# EAGLE design mainboard (EAGLE 9.4.0)
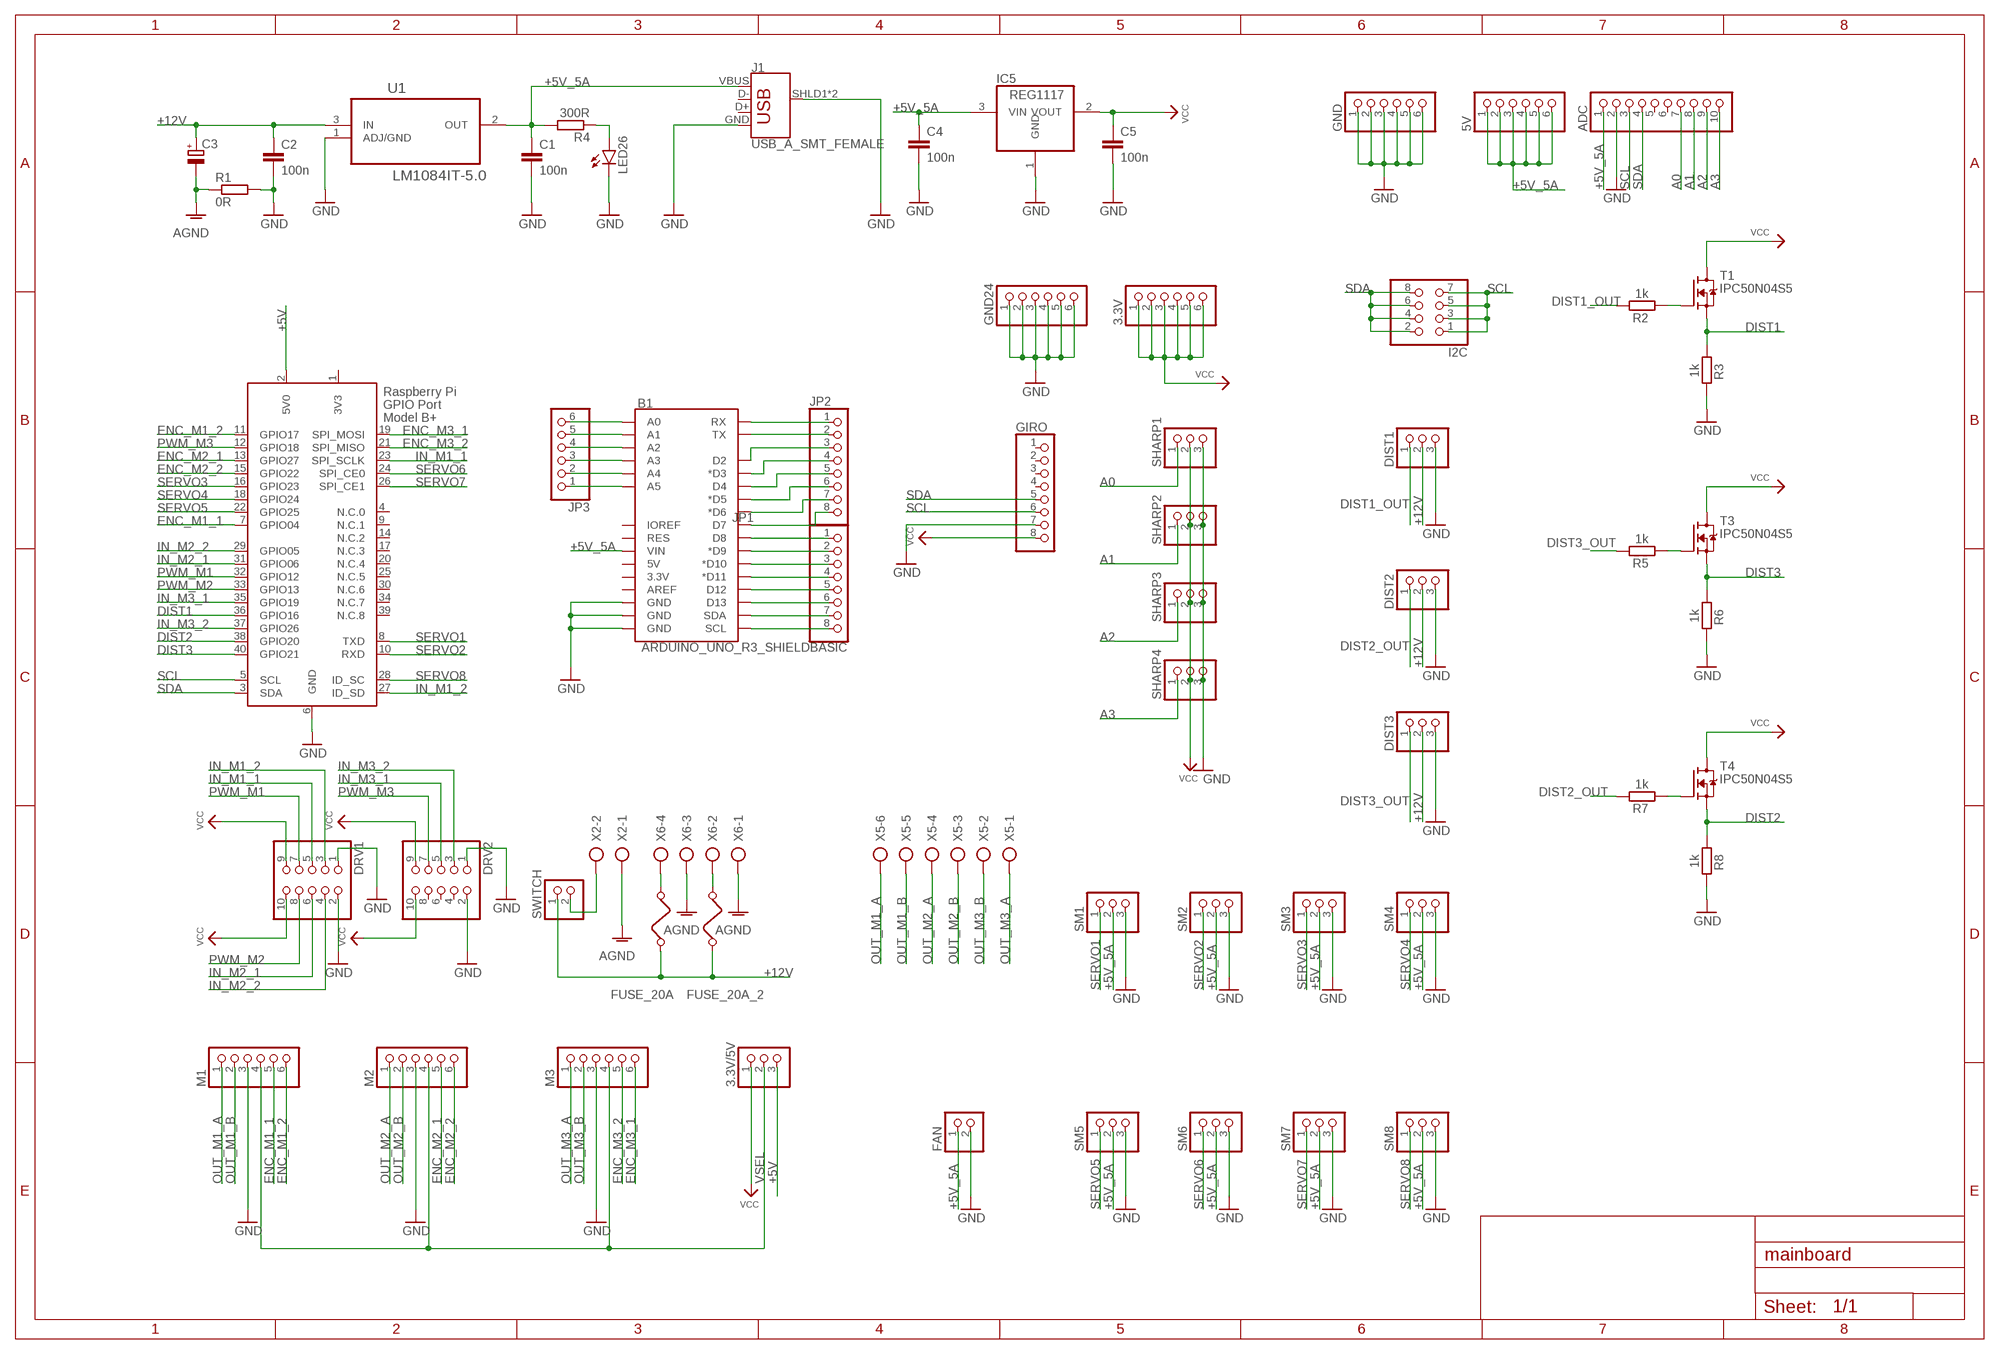
[diagram p0: schematic, sheet 1]

## Parts
3.3V  PINHD-1X6  [1X06]
3.3V/5V  PINHD-1X3  [1X03]
5V  PINHD-1X6  [1X06]
ADC  PINHD-1X10  [1X10]
B1  ARDUINO_UNO_R3_SHIELDBASIC  [UNO_R3_SHIELD]
C1  100n  C-EUC0805  [C0805]
C2  100n  C-EUC0805  [C0805]
C3  UCD1V221MNL1GS  [CAPAE830X1050]
C4  100n  C-EUC0805  [C0805]
C5  100n  C-EUC0805  [C0805]
DIST1  PINHD-1X3  [1X03]
DIST2  PINHD-1X3  [1X03]
DIST3  PINHD-1X3  [1X03]
DRV1  PINHD-2X5  [2X05]
DRV2  PINHD-2X5  [2X05]
FAN  PINHD-1X2  [1X02]
FUSE_20A  FUSE  [FUSE]
FUSE_20A_2  FUSE  [FUSE]
GIRO  PINHD-1X8  [1X08]
GND  PINHD-1X6  [1X06]
GND24  PINHD-1X6  [1X06]
I2C  PINHD-2X4  [2X04]
IC5  REG1117  [SOT223]
J1  USB_A_SMT_FEMALE  [USB-A-S-SILK-FEMALE]
JP1  PINHD-1X8  [1X08]
JP2  PINHD-1X8  [1X08]
JP3  PINHD-1X6  [1X06]
LED26  LEDCHIP-LED0805  [CHIP-LED0805]
M1  PINHD-1X6  [1X06]
M2  PINHD-1X6  [1X06]
M3  PINHD-1X6  [1X06]
R1  0R  R-EU_M0805  [M0805]
R2  1k  R-EU_R0805  [R0805]
R3  1k  R-EU_R0805  [R0805]
R4  300R  R-EU_R0805  [R0805]
R5  1k  R-EU_R0805  [R0805]
R6  1k  R-EU_R0805  [R0805]
R7  1k  R-EU_R0805  [R0805]
R8  1k  R-EU_R0805  [R0805]
SHARP1  PINHD-1X3  [1X03]
SHARP2  PINHD-1X3  [1X03]
SHARP3  PINHD-1X3  [1X03]
SHARP4  PINHD-1X3  [1X03]
SM1  PINHD-1X3  [1X03]
SM2  PINHD-1X3  [1X03]
SM3  PINHD-1X3  [1X03]
SM4  PINHD-1X3  [1X03]
SM5  PINHD-1X3  [1X03]
SM6  PINHD-1X3  [1X03]
SM7  PINHD-1X3  [1X03]
SM8  PINHD-1X3  [1X03]
SWITCH  PINHD-1X2  [1X02]
T1  IPC50N04S5  [PG-TDSON-8-33]
T3  IPC50N04S5  [PG-TDSON-8-33]
T4  IPC50N04S5  [PG-TDSON-8-33]
U1  LM1084IT-5.0  [TO254P470X1016X2222-3P]
X1  RASPI_BOARD_B+_FP  [RASPI_BOARD_B+_FULL_PAD]
X2  AK500/2  [AK500/2]
X5  AK500/6  [AK500/6]
X6  AK500/4  [AK500/4]

## Nets
+5V: 3.3V/5V.3 X1.2(5V0)
+5V_5A: 5V.1 5V.2 5V.3 5V.4 5V.5 5V.6 ADC.1 B1.VIN C1.1 C4.1 FAN.1 IC5.3(VIN) J1.VBUS R4.2 SM1.2 SM2.2 SM3.2 SM4.2 SM5.2 SM6.2 SM7.2 SM8.2 U1.2(OUT)
+12V: C2.1 C3.1(+) DIST1.2 DIST2.2 DIST3.2 FUSE_20A.1 FUSE_20A_2.1 SWITCH.1 U1.3(IN)
A0: ADC.7 SHARP1.1
A1: ADC.8 SHARP2.1
A2: ADC.9 SHARP3.1
A3: ADC.10 SHARP4.1
AGND: C3.2(-) R1.1 X2.1 X6.1 X6.3
DIST1: R3.1 T1.2(S) X1.36(GPIO16)
DIST1_OUT: DIST1.1 R2.2
DIST2: R8.1 T4.2(S) X1.38(GPIO20)
DIST2_OUT: DIST2.1 R7.2
DIST3: R6.1 T3.2(S) X1.40(GPIO21)
DIST3_OUT: DIST3.1 R5.2
ENC_M1_1: M1.5 X1.7(GPIO04)
ENC_M1_2: M1.6 X1.11(GPIO17)
ENC_M2_1: M2.5 X1.13(GPIO27)
ENC_M2_2: M2.6 X1.15(GPIO22)
ENC_M3_1: M3.6 X1.19(SPI_MOSI)
ENC_M3_2: M3.5 X1.21(SPI_MISO)
GND: ADC.2 B1.GND@0(GND) B1.GND@1(GND) B1.GND@2(GND) C1.2 C2.2 C4.2 C5.2 DIST1.3 DIST2.3 DIST3.3 DRV1.1 DRV1.2 DRV2.1 DRV2.2 FAN.2 GIRO.7 GND24.1 GND24.2 GND24.3 GND24.4 GND24.5 GND24.6 GND.1 GND.2 GND.3 GND.4 GND.5 GND.6 IC5.1(GND) J1.GND J1.SHLD1(SHIELD) J1.SHLD2(SHIELD) LED26.C M1.3 M2.3 M3.3 R1.2 R3.2 R6.2 R8.2 SHARP1.3 SHARP2.3 SHARP3.3 SHARP4.3 SM1.3 SM2.3 SM3.3 SM4.3 SM5.3 SM6.3 SM7.3 SM8.3 U1.1(ADJ/GND) X1.6(GND)
IN_M1_1: DRV1.5 X1.23(SPI_SCLK)
IN_M1_2: DRV1.3 X1.27(ID_SD)
IN_M2_1: DRV1.6 X1.31(GPIO06)
IN_M2_2: DRV1.4 X1.29(GPIO05)
IN_M3_1: DRV2.5 X1.35(GPIO19)
IN_M3_2: DRV2.3 X1.37(GPIO26)
N$1: FUSE_20A.2 X6.4
N$2: FUSE_20A_2.2 X6.2
N$3: SWITCH.2 X2.2
N$4: LED26.A R4.1
N$13: B1.RX JP2.1
N$14: B1.D8 JP1.1
N$15: B1.D9(*D9) JP1.2
N$16: B1.D10(*D10) JP1.3
N$17: B1.D11(*D11) JP1.4
N$18: B1.D12 JP1.5
N$19: B1.D13 JP1.6
N$20: B1.SDA JP1.7
N$21: B1.SCL JP1.8
N$22: B1.TX JP2.2
N$23: B1.D2 JP2.3
N$24: B1.D3(*D3) JP2.4
N$25: B1.D4 JP2.5
N$26: B1.D5(*D5) JP2.6
N$27: B1.D6(*D6) JP2.7
N$28: B1.D7 JP2.8
N$29: B1.A0 JP3.6
N$30: B1.A1 JP3.5
N$31: B1.A2 JP3.4
N$32: B1.A3 JP3.3
N$33: B1.A4 JP3.2
N$34: B1.A5 JP3.1
N$39: R2.1 T1.3(G)
N$41: R5.1 T3.3(G)
N$45: R7.1 T4.3(G)
OUT_M1_A: M1.1 X5.6
OUT_M1_B: M1.2 X5.5
OUT_M2_A: M2.1 X5.4
OUT_M2_B: M2.2 X5.3
OUT_M3_A: M3.1 X5.1
OUT_M3_B: M3.2 X5.2
PWM_M1: DRV1.7 X1.32(GPIO12)
PWM_M2: DRV1.8 X1.33(GPIO13)
PWM_M3: DRV2.7 X1.12(GPIO18)
SCL: ADC.3 GIRO.6 I2C.1 I2C.3 I2C.5 I2C.7 X1.5(SCL)
SDA: ADC.4 GIRO.5 I2C.2 I2C.4 I2C.6 I2C.8 X1.3(SDA)
SERVO1: SM1.1 X1.8(TXD)
SERVO2: SM2.1 X1.10(RXD)
SERVO3: SM3.1 X1.16(GPIO23)
SERVO4: SM4.1 X1.18(GPIO24)
SERVO5: SM5.1 X1.22(GPIO25)
SERVO6: SM6.1 X1.24(SPI_CE0)
SERVO7: SM7.1 X1.26(SPI_CE1)
SERVO8: SM8.1 X1.28(ID_SC)
VCC: 3.3V.1 3.3V.2 3.3V.3 3.3V.4 3.3V.5 3.3V.6 3.3V/5V.1 C5.1 DRV1.9 DRV1.10 DRV2.9 DRV2.10 GIRO.8 IC5.2(VOUT) SHARP1.2 SHARP2.2 SHARP3.2 SHARP4.2 T1.1(D) T3.1(D) T4.1(D)
VSEL: 3.3V/5V.2 M1.4 M2.4 M3.4
Unconnected: ADC.5 ADC.6 B1.3.3V B1.5V B1.AREF B1.IOREF B1.RES DRV2.4 DRV2.6 DRV2.8 GIRO.1 GIRO.2 GIRO.3 GIRO.4 J1.D+ J1.D- X1.4(N.C.0) X1.9(N.C.1) X1.14(N.C.2) X1.17(N.C.3) X1.20(N.C.4) X1.25(N.C.5) X1.30(N.C.6) X1.34(N.C.7) X1.39(N.C.8)

## Power pins joined to a net without a drawn wire
3V3: X1.1(3V3)

## Library data of the parts
3.3V 5V GND GND24 JP3 M1-M3 = pinhead:PINHD-1X6: PIN HEADER
3.3V/5V DIST1-DIST3 SHARP1-SHARP4 SM1-SM8 = pinhead:PINHD-1X3: PIN HEADER
ADC = pinhead:PINHD-1X10: PIN HEADER
B1 = SparkFun-Boards:ARDUINO_UNO_R3_SHIELD: Arduino R3 Shield Footprint Shield form compatible with the Arduino Uno R3. SparkFun Products: MG2639 Cellular Shield <https://www.sparkfun.com/products/13120> MIDI Shield <https://www.sparkfun.com/products/12898> R3 Stackable Headers Kit <https://www.sparkfun.com/products/11417>
C1 C2 C4 C5 = rcl:C-EU: CAPACITOR, European symbol; SPICEPREFIX: C
C3 = rosbotlib:UCD1V221MNL1GS
DRV1 DRV2 = pinhead:PINHD-2X5: PIN HEADER
FAN SWITCH = pinhead:PINHD-1X2: PIN HEADER
FUSE_20A FUSE_20A_2 = special:FUSE: FUSE 5 x 20 mm
GIRO JP1 JP2 = pinhead:PINHD-1X8: PIN HEADER
I2C = pinhead:PINHD-2X4: PIN HEADER
IC5 = burr-brown:REG1117: 800mA and 1A Low Dropout (LDO) Positive Regulator 1.8V, 2.5V, 2.85V, 3.3V, 5V, and Adj; MPN: REG1117; OC_FARNELL: 1097566; OC_NEWARK: 14P6981
J1 = SparkFun-Connectors:USB_A: USB-A Connector Male and female variants, as well as PTH and SMT variants SparkFun Products: SparkFun XBee Explorer Dongle <https://www.sparkfun.com/products/11697> PTH Male SparkFun MicroView-USB Programmer <https://www.sparkfun.com/products/12924> SMT Male SparkFun USB Type A Female Breakout <https://www.sparkfun.com/products/12700> SMT Female; PROD_ID: CONN-09520; SF_ID: PRT-09011
LED26 = led:LED: LED OSRAM: - CHIPLED LG R971, LG N971, LY N971, LG Q971, LY Q971, LO R971, LY R971 LH N974, LH R974 LS Q976, LO Q976, LY Q976 LO Q996 - Hyper CHIPLED LW Q18S LB Q993, LB Q99A, LB R99A - SideLED LS A670, LO A670, LY A670, LG A670, LP A670 LB A673, LV A673, LT A673, LW A673 LH A674 LY A675 LS A676, LA A676, LO A676, LY A676, LW A676 LS A679, LY A679, LG A679 - Hyper Micro SIDELED® LS Y876, LA Y876, LO Y876, LY Y876 LT Y87S - SmartLED LW L88C, LW L88S LB L89C, LB L89S, LG L890 LS L89K, LO L89K, LY L89K LS L896, LA L896, LO L896, LY L896 - TOPLED LS T670, LO T670, LY T670, LG T670, LP T670 LSG T670, LSP T670, LSY T670, LOP T670, LYG T670 LG T671, LOG T671, LSG T671 LB T673, LV T673, LT T673, LW T673 LH T674 LS T676, LA T676, LO T676, LY T676, LB T676, LH T676, LSB T676, LW T676 LB T67C, LV T67C, LT T67C, LS T67K, LO T67K, LY T67K, LW E67C LS E67B, LA E67B, LO E67B, LY E67B, LB E67C, LV E67C, LT E67C LW T67C LS T679, LY T679, LG T679 LS T770, LO T770, LY T770, LG T770, LP T770 LB T773, LV T773, LT T773, LW T773 LH T774 LS E675, LA E675, LY E675, LS T675 LS T776, LA T776, LO T776, LY T776, LB T776 LHGB T686 LT T68C, LB T68C - Hyper Mini TOPLED® LB M676 - Mini TOPLED Santana® LG M470 LS M47K, LO M47K, LY M47K Source: http://www.osram.convergy.de LUXEON: - LUMILED® LXK2-PW12-R00, LXK2-PW12-S00, LXK2-PW14-U00, LXK2-PW14-V00 LXK2-PM12-R00, LXK2-PM12-S00, LXK2-PM14-U00 LXK2-PE12-Q00, LXK2-PE12-R00, LXK2-PE12-S00, LXK2-PE14-T00, LXK2-PE14-U00 LXK2-PB12-K00, LXK2-PB12-L00, LXK2-PB12-M00, LXK2-PB14-N00, LXK2-PB14-P00, LXK2-PB14-Q00 LXK2-PR12-L00, LXK2-PR12-M00, LXK2-PR14-Q00, LXK2-PR14-R00 LXK2-PD12-Q00, LXK2-PD12-R00, LXK2-PD12-S00 LXK2-PH12-R00, LXK2-PH12-S00 LXK2-PL12-P00, LXK2-PL12-Q00, LXK2-PL12-R00 Source: www.luxeon.com KINGBRIGHT: KA-3528ASYC Source: www.kingbright.com
R1-R8 = rcl:R-EU_: RESISTOR, European symbol; SPICEPREFIX: R
T1 T3 T4 = transistors:IPC50N04S5
U1 = LM1084IT-5.0:LM1084IT-5.0: IC, LDO VOLT REG, 5V, 5A; AVAILABILITY: Unavailable; DESCRIPTION: Linear Voltage Regulator IC 1 Output 5A TO-220-3; MF: Texas Instruments; MP: LM1084IT-5.0; PACKAGE: TO-220 Texas Instruments; PRICE: None
X1 = raspberrypi_bastelstube_v13:RASPI_BOARD_B+: Raspberry Pi GPIO connector with markings for the outer dimensions of the Raspberry Pi board model B+ with different sets of drill holes or mounting pads
X2 = con-ptr500:AK500/2: CONNECTOR; OC_FARNELL: unknown; OC_NEWARK: unknown
X5 = con-ptr500:AK500/6: CONNECTOR; OC_FARNELL: unknown; OC_NEWARK: unknown
X6 = con-ptr500:AK500/4: CONNECTOR; OC_FARNELL: unknown; OC_NEWARK: unknown

## Board
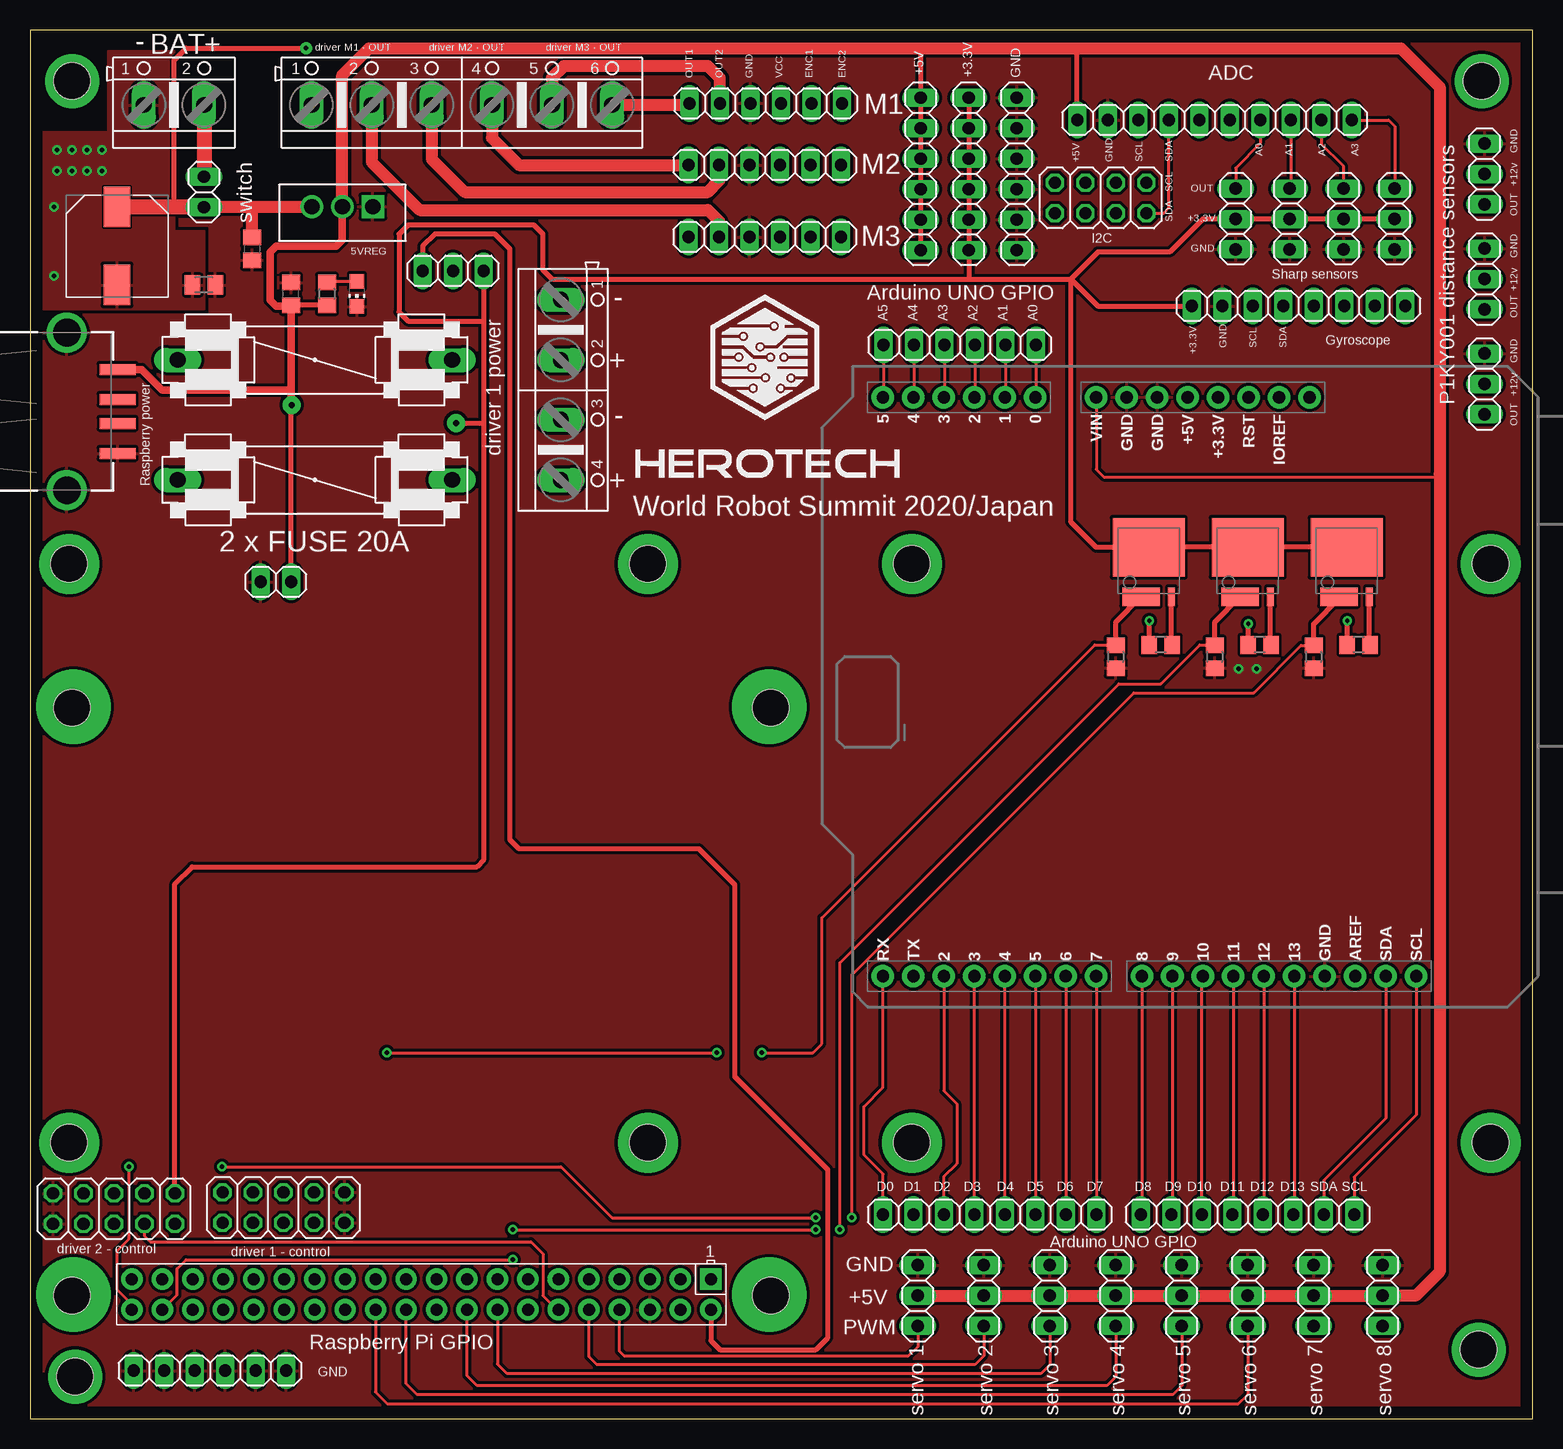
[diagram p1: board, top side]
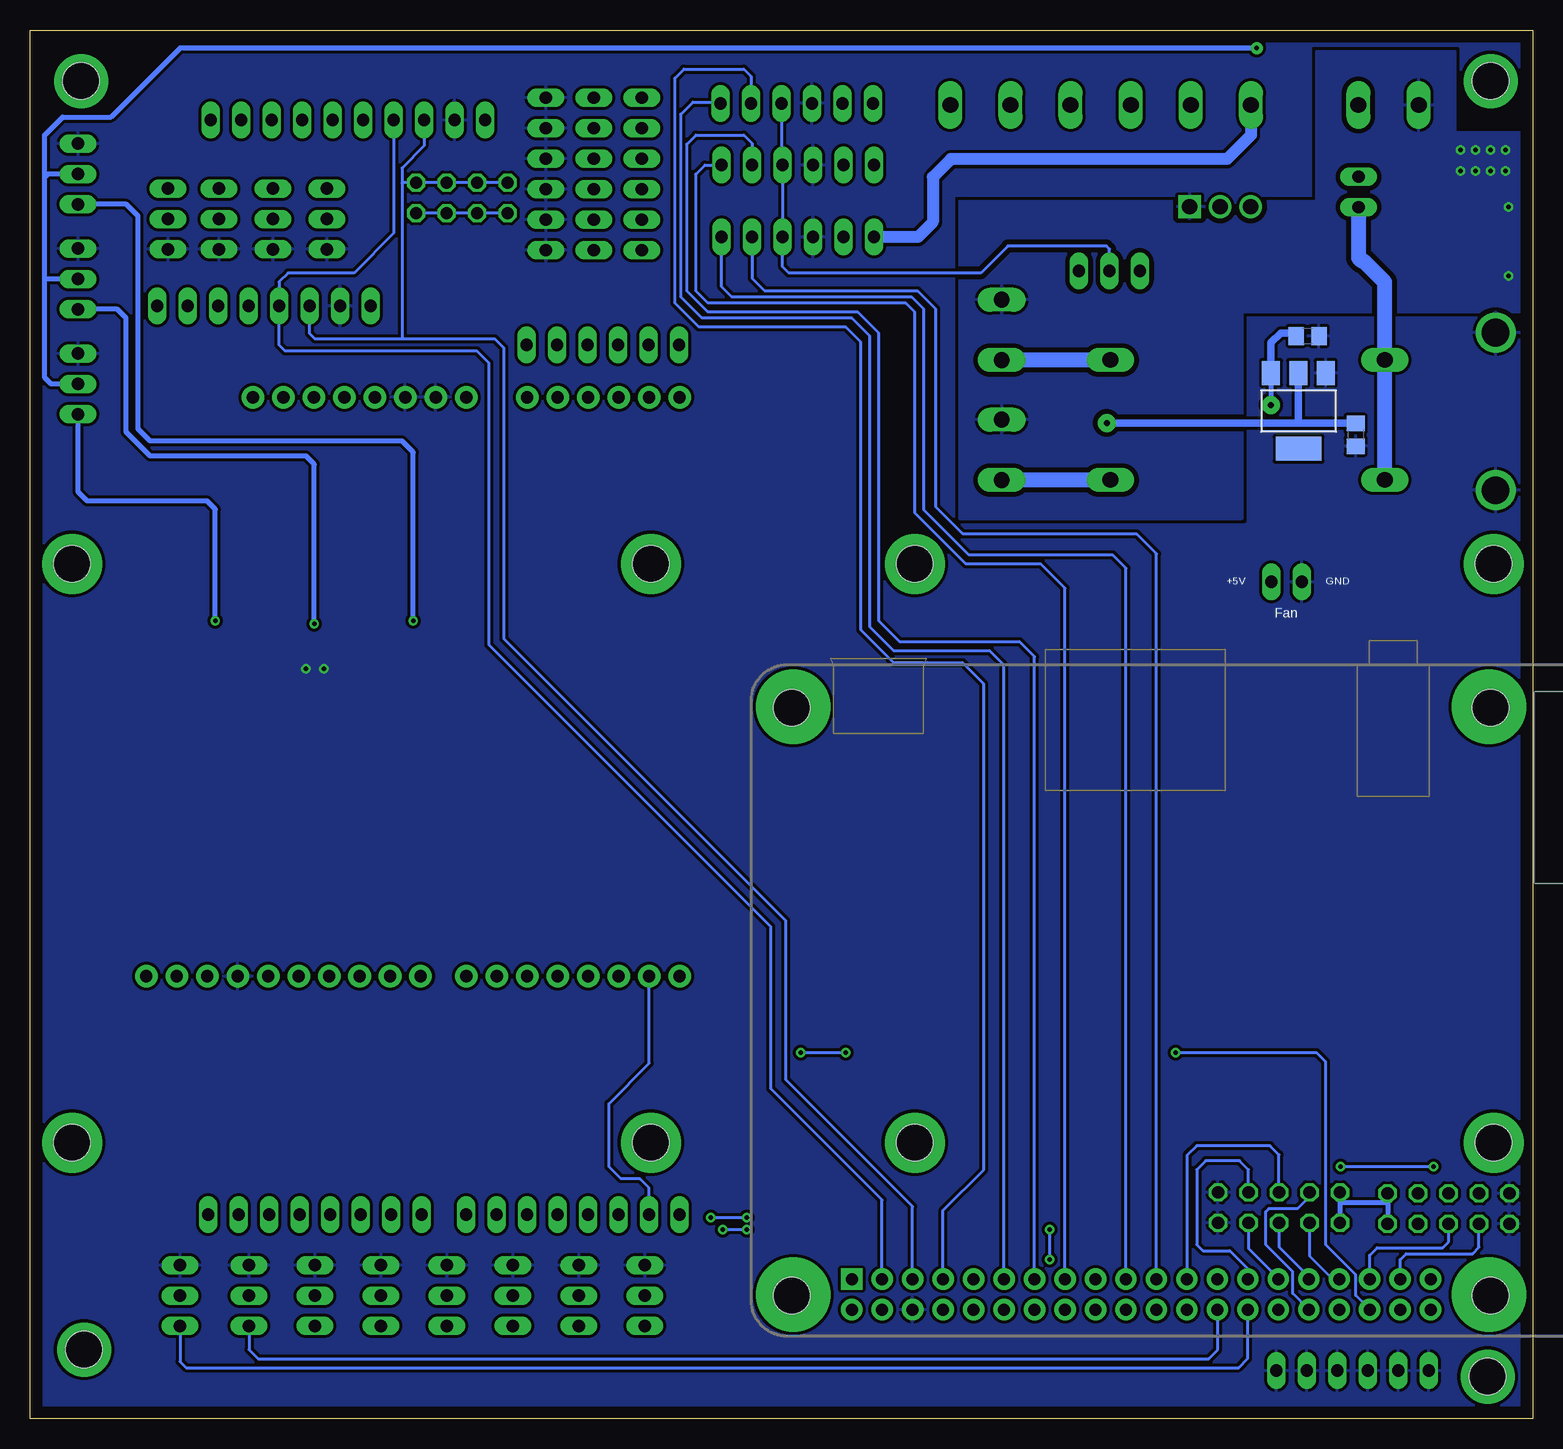
[diagram p2: board, bottom side, seen from below]

Size 125.25 x 115.75 mm. Coordinates in mm from the lower left corner, seen from the top.
Outline: 0,0 125.25,0 125.25,115.75 0,115.75 0,0
Copper layers (1*16): Top 0.035mm / dielectric 1.5mm / Bottom 0.035mm
Design rules "default": minimum track width 6mil, minimum drill 0.35mm, track to track 6mil, track to pad 6mil, pad to pad 6mil, via to via 6mil, smd to smd 6mil, copper to edge 40mil, drill to drill 6mil, minimum pad ring 10mil, minimum via ring 8mil, stop-mask expansion 4mil, vias tented up to drill 0mil, thermal gap 10mil
Holes 3 mm at 3.5,111.5 3.25,71.25 51.5,71.25 3.25,23 51.5,23 73.5,71.25 73.5,23 121.75,71.25 121.75,23 3.5,59.25 61.75,59.25 61.75,10.25 3.5,10.25 120.75,5.75 121,111.5 3.75,3.5

### Footprints (pad centres in the part's own frame; a part is rotated, then mirrored left to right if it is on the bottom)
1X06 = drill 1.016 long: 1 -6.35,0; 2 -3.81,0; 3 -1.27,0; 4 1.27,0; 5 3.81,0; 6 6.35,0
1X03 = drill 1.016 long: 1 -2.54,0; 2 0,0; 3 2.54,0
1X10 = drill 1.016 long: 1 -11.43,0; 2 -8.89,0; 3 -6.35,0; 4 -3.81,0; 5 -1.27,0; 6 1.27,0; 7 3.81,0; 8 6.35,0; 9 8.89,0; 10 11.43,0
UNO_R3_SHIELD = drill 1.016 pad 1.88: 3.3V 24.13,-2.54; 5V 24.13,0; A0 24.13,12.7; A1 24.13,15.24; A2 24.13,17.78; A3 24.13,20.32; A4 24.13,22.86; A5 24.13,25.4; AREF -24.13,-13.97; D2 -24.13,20.32; D3 -24.13,17.78; D4 -24.13,15.24; D5 -24.13,12.7; D6 -24.13,10.16; D7 -24.13,7.62; D8 -24.13,3.81; D9 -24.13,1.27; D10 -24.13,-1.27; D11 -24.13,-3.81; D12 -24.13,-6.35; D13 -24.13,-8.89; GND@0 24.13,2.54; GND@1 24.13,5.08; GND@2 -24.13,-11.43; IOREF 24.13,-7.62; NC 24.13,-10.16; RES 24.13,-5.08; RX -24.13,25.4; SCL -24.13,-19.05; SDA -24.13,-16.51; TX -24.13,22.86; VIN 24.13,7.62
C0805 = smd 1.3 x 1.5: 1 -0.95,0; 2 0.95,0
CAPAE830X1050 = smd 3.414 x 2.212: 1 -3.251,0; 2 3.251,0
2X05 = drill 1.016 octagon: 1 -5.08,-1.27; 2 -5.08,1.27; 3 -2.54,-1.27; 4 -2.54,1.27; 5 0,-1.27; 6 0,1.27; 7 2.54,-1.27; 8 2.54,1.27; 9 5.08,-1.27; 10 5.08,1.27
1X02 = drill 1.016 long: 1 -1.27,0; 2 1.27,0
FUSE = drill 1.321 long: 1 -11.43,0; 2 11.43,0
1X08 = drill 1.016 long: 1 -8.89,0; 2 -6.35,0; 3 -3.81,0; 4 -1.27,0; 5 1.27,0; 6 3.81,0; 7 6.35,0; 8 8.89,0
2X04 = drill 1.016 octagon: 1 -3.81,-1.27; 2 -3.81,1.27; 3 -1.27,-1.27; 4 -1.27,1.27; 5 1.27,-1.27; 6 1.27,1.27; 7 3.81,-1.27; 8 3.81,1.27
SOT223 = smd 1.499 x 2.007: 1 -2.261,-3.15; 2 0.025,-3.15; 3 2.311,-3.15 | smd 3.81 x 2.007: 4 0,3.15
USB-A-S-SILK-FEMALE = smd 3 x 0.9: D+ 7.212,-1; D- 7.212,1; GND 7.212,-3.5; VBUS 7.212,3.5 | drill 2.311: SHLD1 3,-6.566; SHLD2 3,6.566
CHIP-LED0805 = smd 1.2 x 1.2: A 0,-1.05; C 0,1.05
M0805 = smd 1.3 x 1.6: 1 -0.95,0; 2 0.95,0
R0805 = smd 1.3 x 1.5: 1 -0.95,0; 2 0.95,0
PG-TDSON-8-33 = smd 6 x 4.9: 1 0,1.13 | smd 3.14 x 1.55: 2 -0.635,-2.995 | smd 0.6 x 1.55: 3 1.905,-2.995
TO254P470X1016X2222-3P = drill 1.27 square: 1 -5.08,-1.016 | drill 1.27: 2 -2.54,-1.016; 3 0,-1.016
RASPI_BOARD_B+_FULL_PAD = drill 1 pad 1.778 square: 1 8.37,51.23 | drill 1 pad 1.778: 2 8.37,53.77; 3 10.91,51.23; 4 10.91,53.77; 5 13.45,51.23; 6 13.45,53.77; 7 15.99,51.23; 8 15.99,53.77; 9 18.53,51.23; 10 18.53,53.77; 11 21.07,51.23; 12 21.07,53.77; 13 23.61,51.23; 14 23.61,53.77; 15 26.15,51.23; 16 26.15,53.77; 17 28.69,51.23; 18 28.69,53.77; 19 31.23,51.23; 20 31.23,53.77; 21 33.77,51.23; 22 33.77,53.77; 23 36.31,51.23; 24 36.31,53.77; 25 38.85,51.23; 26 38.85,53.77; 27 41.39,51.23; 28 41.39,53.77; 29 43.93,51.23; 30 43.93,53.77; 31 46.47,51.23; 32 46.47,53.77; 33 49.01,51.23; 34 49.01,53.77; 35 51.55,51.23; 36 51.55,53.77; 37 54.09,51.23; 38 54.09,53.77; 39 56.63,51.23; 40 56.63,53.77 | drill 2.75 pad 6.2: DRILL_1 3.5,52.5; DRILL_2 61.5,52.5; DRILL_3 3.5,3.5; DRILL_4 61.5,3.5
AK500/2 = drill 1.321 long: 1 -2.515,0; 2 2.515,0
AK500/6 = drill 1.321 long: 1 -12.522,0; 2 -7.518,0; 3 -2.515,0; 4 2.515,0; 5 7.518,0; 6 12.522,0
AK500/4 = drill 1.321 long: 1 -7.518,0; 2 -2.489,0; 3 2.489,0; 4 7.518,0

### Placement (x,y rotation side)
3.3V  78.25,103.75 270 top
3.3V/5V  35.27,95.67 180 top
5V  74.25,103.75 270 top
ADC  98.75,108.25 0 top
B1  96.5,61 90 top
C1  21.75,93.75 90 top
C2  18.5,97.5 270 top
C3  7.25,97.75 270 top
C4  18.75,90.25 0 bottom
C5  14.75,82 270 bottom
DIST1  121.25,103.75 90 top
DIST2  121.25,95 90 top
DIST3  121.25,86.25 90 top
DRV1  21.13,17.58 180 top
DRV2  7,17.5 0 top
FAN  20.5,69.75 180 top
FUSE_20A  23.75,78.25 0 top
FUSE_20A_2  23.75,88.25 0 top
GIRO  105.75,92.75 180 top
GND  15,4 0 top
GND24  82.25,103.75 270 top
I2C  89.25,101.75 180 top
IC5  19.5,84 180 bottom
J1  0.08,83.95 0 top
JP1  101.5,17 0 top
JP2  80,17 0 top
JP3  77.5,89.5 0 top
LED26  27.25,93.75 180 top
M1  61.33,109.63 0 top
M2  61.25,104.5 0 top
M3  61.25,98.5 0 top
R1  14.5,94.5 0 top
R2  94.25,64.5 180 top
R3  90.5,63.5 270 top
R4  24.75,93.75 270 top
R5  110.75,64.5 180 top
R6  107,63.5 270 top
R7  102.5,64.5 180 top
R8  98.75,63.5 270 top
SHARP1  100.5,100 270 top
SHARP2  105,100 270 top
SHARP3  109.5,100 270 top
SHARP4  113.75,100 270 top
SM1  74,10.25 90 top
SM2  79.5,10.25 90 top
SM3  85,10.25 90 top
SM4  90.5,10.25 90 top
SM5  96,10.25 90 top
SM6  101.5,10.25 90 top
SM7  107,10.25 90 top
SM8  112.75,10.25 90 top
SWITCH  14.5,102.25 90 top
T1  93.25,71.5 0 top
T3  109.75,71.5 0 top
T4  101.5,71.5 0 top
U1  23.5,100 180 top
X1  65.12,62.85 180 top
X2  12,109.5 0 top
X5  36,109.5 0 top
X6  44.25,85.75 270 top

### Tracks (layer width: path | path; a pad name or v marks a point on that pad's centre or on a via)
+5V
  Top 0.406: X1.2 56.75,6.5 57.5,5.75 65.5,5.75 66.5,6.75 66.5,20.75 58.75,28.5 58.75,44.5 55.75,47.5 40.75,47.5 40,48.25 40,97.5 38.75,98.75 33.75,98.75 32.73,97.73 3.3V/5V.3
+5V_5A  (via drill 0.5 pad 1.5)
  Top 0.254: 117.5,78.75 117.25,78.5 89.5,78.5 88.88,79.12 B1.VIN | 74.25,113.98 74.5,114.23
  Top 0.406: R4.2 C1.1 21.7,92.75 | 5V.6 5V.5 5V.4 5V.3 5V.2 5V.1 74.25,113.98 | ADC.1 87.25,108.32 87.25,114.23 | v21.81,84.5 21.78,84.53 | 21.78,84.53 21.75,84.56 | FAN.1 21.77,84.52 21.78,84.53
  Top 0.61: J1.VBUS 9.3,87.45 11,85.75 21.75,85.75 | 21.75,84.56 21.75,85.75 | 21.75,85.75 C1.1 | U1.2 26.04,98.25 25.54,97.75 20.5,97.75 20,97.25 20,93.25 20.5,92.75 21.7,92.75
  Top 1.016: SM1.2 SM2.2 SM3.2 SM4.2 SM5.2 SM6.2 SM7.2 SM8.2 115.5,10.25 117.5,12.25 117.5,78.75 117.5,111 114.27,114.23 87.25,114.23 74.5,114.23 28.27,114.23 26.04,112 U1.2
  Bottom 0.406: IC5.3 v21.81,84.5
  Bottom 0.61: C4.1 19.95,90.5 21,90.5 21.81,89.69 IC5.3
+12V  (via drill 0.35 pad 1)
  Top 0.406: SWITCH.1 17.23,100.98 | 12,100.98 12,113.25 13,114.25 v23,114.25
  Top 1.016: SWITCH.1 14.54,101.02 18.75,101.02 | 18.75,101.02 U1.3 | C2.1 18.5,100.77 18.75,101.02
  Top 1.27: C3.1 7.27,100.98 12,100.98 SWITCH.1
  Bottom 0.406: DIST3.2 123.5,86.25 124.03,86.78 124.03,95 | 124.03,95 124.03,103.5 | 124.03,103.5 124.03,107 122.53,108.5 118.5,108.5 112.75,114.25 v23,114.25 | DIST1.2 123.78,103.75 124.03,103.5 | DIST2.2 124.03,95
  Bottom 1.27: FUSE_20A.1 FUSE_20A_2.1 12.32,94.75 14.07,96.5 14.25,96.5 14.5,96.75 SWITCH.1
A0
  Top 0.254: ADC.7 102.56,106.31 100.5,104.25 SHARP1.1
A1
  Top 0.254: ADC.8 105.1,102.64 SHARP2.1
A2
  Top 0.254: ADC.9 107.64,106.25 109.5,104.39 SHARP3.1
A3
  Top 0.254: ADC.10 113.25,108.25 113.75,107.75 SHARP4.1
AGND  (via drill 0.35 pad 0.6)
  other vias: 2.25,105.75 3.5,105.75 4.75,105.75 6,105.75 2.25,104 3.5,104 4.75,104 6,104 2,101 2,95.25
  pour Top: 6.5,114 6.5,107.25 1,107.25 1,92.5 14.5,92.5 14.5,99 12,99 12,114
  pour Bottom (isolate 0.406): 6.5,114 6.5,107.25 1,107.25 1,92.25 24.25,92.25 24.25,75 47.75,75 47.75,101.5 18,101.5 18,114
DIST1  (via drill 0.35 pad 0.5)
  Top 0.254: v29.75,30.5 v57.25,30.5 | v61,30.5 65.25,30.5 66,31.25 66,41.75 88.75,64.5 90.5,64.5
  Top 0.406: T1.2 90.5,66.39 90.5,64.5 R3.1
  Bottom 0.254: X1.36 14.75,10.26 14.75,12 17.25,14.5 17.25,29.75 18,30.5 v29.75,30.5 | v57.25,30.5 v61,30.5
DIST1_OUT  (via drill 0.35 pad 0.5)
  Top 0.406: R2.2 v93.3,66.5
  Bottom 0.406: v93.3,66.5 93.3,80.55 94.25,81.5 115.25,81.5 116.25,82.5 116.25,100.25 117.21,101.21 DIST1.1
DIST2  (via drill 0.35 pad 0.5)
  Top 0.254: X1.38 12.25,10.3 12.25,12.5 13,13.25 v40.25,13.25 | v40.25,15.75 v65.5,15.75 | v67.5,15.75 67.5,38 90.75,61.25 94.25,61.25 97.5,64.5 98.75,64.5
  Top 0.406: T4.2 98.75,66.39 98.75,64.5 R8.1
  Bottom 0.254: v40.25,13.25 v40.25,15.75 | v65.5,15.75 v67.5,15.75
DIST2_OUT  (via drill 0.35 pad 0.5)
  Top 0.406: R7.2 v101.55,66.25
  Bottom 0.406: v101.55,66.25 101.55,79.55 102.25,80.25 115.25,80.25 117.25,82.25 117.25,91.75 117.96,92.46 DIST2.1
DIST3  (via drill 0.35 pad 0.5)
  Top 0.254: X1.40 8.49,9.51 7.25,10.75 7.25,14 8.25,15 v8.25,21 | v16,21 44.25,21 48.5,16.75 v65.5,16.75 | R6.1 105.95,64.45 102,60.5 92,60.5 68.5,37 v68.5,16.75
  Top 0.406: R6.1 107,66.25 109.11,68.36 T3.2
  Bottom 0.254: v8.25,21 v16,21 | v65.5,16.75 v68.5,16.75
DIST3_OUT  (via drill 0.35 pad 0.5)
  Top 0.406: R5.2 v109.8,66.5
  Bottom 0.406: DIST3.1 121.25,77.25 120.5,76.5 110.5,76.5 109.8,75.8 v109.8,66.5
ENC_M1_1
  Bottom 0.254: X1.7 49.13,17.37 45.75,20.75 45.75,61.25 47.5,63 53.25,63 56,65.75 56,89.75 57.25,91 69.5,91 71.5,93 71.5,111.75 70.75,112.5 65.75,112.5 65.14,111.89 M1.5
ENC_M1_2
  Bottom 0.254: X1.11 44.05,62.8 45.25,64 53.25,64 55.25,66 55.25,90.25 56.75,91.75 69.25,91.75 71,93.5 71,108.75 70,109.75 67.8,109.75 M1.6
ENC_M2_1
  Bottom 0.254: X1.13 41.51,63.51 42.75,64.75 52.75,64.75 54.5,66.5 54.5,90.5 56.25,92.25 68.75,92.25 70.5,94 70.5,106.25 69.75,107 65.75,107 65.06,106.31 M2.5
ENC_M2_2
  Bottom 0.254: X1.15 38.97,69.22 41,71.25 47.25,71.25 51.5,75.5 51.5,92.25 52.25,93 68.75,93 69.75,94 69.75,103.75 69,104.5 M2.6
ENC_M3_1
  Bottom 0.254: X1.19 33.89,70.89 35,72 47,72 50.75,75.75 50.75,92.5 51.75,93.5 66.75,93.5 67.6,94.35 M3.6
ENC_M3_2
  Bottom 0.254: X1.21 31.35,72.1 33,73.75 47.5,73.75 49.75,76 49.75,92.5 51.25,94 64,94 65.06,95.06 M3.5
GND  (via drill 0.35 pad 0.5)
  other vias: 100.75,62.5 102.25,62.5
  pour Top (isolate 0.254, rank 2): -0.25,114.75 124.75,114.75 124.75,0 -0.25,0
  pour Bottom (isolate 0.254, rank 2): 0.25,114.75 124.75,114.75 124.75,0.25 0.25,0.25
IN_M1_1
  Bottom 0.254: X1.23 28.81,21.94 28,22.75 21.88,22.75 21.13,22 DRV1.5
IN_M1_2
  Bottom 0.254: X1.27 23.73,12.48 25.25,14 27.5,14 28,14.5 28,20.75 27.25,21.5 24.42,21.5 23.67,20.75 DRV1.3
IN_M2_1
  Bottom 0.254: DRV1.6 21.13,14.31 18.65,11.83 X1.31
IN_M2_2
  Bottom 0.254: X1.29 21.19,11.69 23.67,14.17 DRV1.4
IN_M3_1
  Bottom 0.254: X1.35 13.57,13.62 12.94,14.25 7.5,14.25 7,14.75 DRV2.5
IN_M3_2
  Bottom 0.254: X1.37 11.03,13.25 10.53,13.75 5,13.75 4.46,14.29 DRV2.3
N$1
  Bottom 1.27: FUSE_20A.2 44.23,78.25 X6.4
N$2
  Bottom 1.27: FUSE_20A_2.2 44.24,88.25 X6.2
N$3
  Top 1.27: X2.2 14.52,103.53 SWITCH.2
N$4
  Top 0.254: R4.1 24.85,94.8 LED26.A
N$5  (via drill 3 pad 5)
  other vias: 3.25,23
N$6  (via drill 3 pad 5)
  other vias: 51.5,23
N$7  (via drill 3 pad 5)
  other vias: 3.25,71.25
N$8  (via drill 3 pad 5)
  other vias: 73.5,71.25
N$9  (via drill 3 pad 5)
  other vias: 121.75,71.25
N$10  (via drill 3 pad 5)
  other vias: 121.75,23
N$11  (via drill 3 pad 5)
  other vias: 73.5,23
N$12  (via drill 3 pad 5)
  other vias: 51.5,71.25
N$13
  Top 0.254: B1.RX 71.1,27.6 69.5,26 69.5,22 71.11,20.39 JP2.1
N$14
  Top 0.254: B1.D8 92.69,17.08 JP1.1
N$15
  Top 0.254: B1.D9 95.23,17.08 JP1.2
N$16
  Top 0.254: JP1.3 97.69,36.79 B1.D10
N$17
  Top 0.254: B1.D11 100.31,17.08 JP1.4
N$18
  Top 0.254: B1.D12 102.85,17.08 JP1.5
N$19
  Top 0.254: B1.D13 105.39,17.08 JP1.6
N$20
  Top 0.254: JP1.7 107.85,19.85 113.01,25.01 B1.SDA
N$21
  Top 0.254: B1.SCL 115.55,25.3 110.39,20.14 JP1.8
N$22
  Bottom 0.254: JP2.2 73.65,19.25 74.4,20 76,20 77,21 77,26.25 73.64,29.61 B1.TX
N$23
  Top 0.254: JP2.3 76.19,20.19 77.25,21.25 77.25,26.25 76.18,27.32 B1.D2
N$24
  Top 0.254: JP2.4 B1.D3
N$25
  Top 0.254: JP2.5 B1.D4
N$26
  Top 0.254: B1.D5 JP2.6
N$27
  Top 0.254: B1.D6 JP2.7
N$28
  Top 0.254: B1.D7 JP2.8
N$29
  Top 0.254: JP3.6 83.85,85.18 B1.A0
N$30
  Top 0.254: JP3.5 81.31,85.18 B1.A1
N$31
  Top 0.254: JP3.4 78.77,85.18 B1.A2
N$32
  Top 0.254: JP3.3 76.23,85.18 B1.A3
N$33
  Top 0.254: JP3.2 73.69,85.18 B1.A4
N$34
  Top 0.254: JP3.1 71.15,85.18 B1.A5
N$35  (via drill 3 pad 4.5)
  other vias: 3.5,111.5
N$36  (via drill 3 pad 4.5)
  other vias: 121,111.5
N$37  (via drill 3 pad 4.5)
  other vias: 120.75,5.75
N$38  (via drill 3 pad 4.5)
  other vias: 3.75,3.5
N$39
  Top 0.406: R2.1 95.16,64.55 T1.3
N$41
  Top 0.406: R5.1 111.66,64.55 T3.3
N$45
  Top 0.406: R7.1 103.41,64.55 T4.3
OUT_M1_A
  Top 1.016: M1.1 54.85,109.5 X5.6
OUT_M1_B
  Top 1.016: X5.5 43.52,111.77 44.5,112.75 56.5,112.75 57.52,111.73 M1.2
OUT_M2_A
  Top 1.016: X5.4 38.52,106.75 40.77,104.5 M2.1
OUT_M2_B
  Top 1.016: M2.2 57.44,103.19 56.5,102.25 36.23,102.25 33.48,105 X5.3
OUT_M3_A
  Bottom 1.016: X5.1 23.48,107 25.48,105 48.5,105 50,103.5 50,99.75 51.25,98.5 M3.1
OUT_M3_B
  Top 1.016: X5.2 28.48,104.75 32.48,100.75 56.5,100.75 57.44,99.81 M3.2
PWM_M1
  Bottom 0.254: DRV1.7 18.59,18.5 19.59,17.5 22,17.5 22.25,17.25 22.25,14.5 20,12.25 20,10.43 X1.32
PWM_M2
  Bottom 0.254: DRV1.8 18.59,13.56 16.65,11.62 X1.33
PWM_M3
  Top 0.254: X1.12 43.92,9.08 42.75,10.25 42.75,13.75 41.75,14.75 10,14.75 9.54,15.21 DRV2.7
SCL
  Bottom 0.254: X1.5 51.67,17.67 62.25,28.25 62.25,41.5 85.75,65 85.75,89.25 86.5,90 94.25,90 | GIRO.6 101.94,90.44 101.5,90 94.25,90 | 92.25,108.1 ADC.3 92.4,106.1 94.25,104.25 94.25,103 | 94.25,103 94.25,90 | I2C.7 I2C.5 I2C.3 I2C.1 94.23,103.02 94.25,103
SDA
  Top 0.254: I2C.2 94.5,100.48 94.94,100.92 ADC.4
  Bottom 0.254: X1.3 54.21,18.21 63.5,27.5 63.5,41 87,64.5 87,88 88,89 104,89 104.48,89.48 GIRO.5 104.48,94.77 103.75,95.5 98.25,95.5 94.94,98.81 ADC.4 | I2C.8 I2C.6 I2C.4 I2C.2
SERVO1
  Top 0.254: SM1.1 74,6 73.19,5.19 49.56,5.19 49.13,5.62 X1.8
SERVO2
  Top 0.254: SM2.1 79.5,5.25 78.75,4.5 47.25,4.5 46.59,5.16 X1.10
SERVO3
  Top 0.254: SM3.1 85,4.5 84.25,3.75 39.75,3.75 38.97,4.53 X1.16
SERVO4
  Top 0.254: SM4.1 90.5,3.5 89.75,2.75 37.25,2.75 36.43,3.57 X1.18
SERVO5
  Top 0.254: SM5.1 96,2.75 95.25,2 32.25,2 31.35,2.9 X1.22
SERVO6
  Top 0.254: SM6.1 101.5,2 100.72,1.22 29.78,1.22 28.81,2.19 X1.24
SERVO7
  Bottom 0.254: SM7.1 107,5.75 106.25,5 27,5 26.25,5.75 26.25,9.06
  Bottom 0.406: 26.25,9.06 X1.26
SERVO8
  Bottom 0.254: SM8.1 112.75,4.75 112.25,4.25 24.5,4.25 23.73,5.02 X1.28
VCC  (via drill 0.5 pad 1.5)
  Top 0.406: 3.3V/5V.1 37.81,91.5 | 37.81,91.5 37.81,83 | 37.81,83 37.81,46.56 37.25,46 13.5,46 12.08,44.58 DRV2.10 | 3.3V.1 3.3V.2 3.3V.3 3.3V.4 3.3V.5 3.3V.6 78.25,95 | 78.25,95 43.5,95 42.75,95.75 42.75,98.75 42,99.5 31.5,99.5 30.75,98.75 30.75,92.25 31.5,91.5 37.81,91.5 | 78.25,95 86.75,95 | SHARP4.2 SHARP3.2 SHARP2.2 SHARP1.2 97.75,100 95,97.25 89,97.25 86.75,95 | v35.5,83 37.81,83 | 86.75,95 89,92.75 GIRO.8 | 86.75,95 86.75,74.75 88.87,72.63 T1.1 T4.1 T3.1
  Bottom 0.406: DRV2.10 12.08,18 | 12.08,18 DRV2.9 | DRV1.9 16.05,18 | 16.05,18 DRV1.10 | 12.08,18 16.05,18
  Bottom 0.61: 19.5,83 v35.5,83 | C5.1 14.8,83 19.5,83 | IC5.2 19.52,83.03 19.5,83
VSEL
  Bottom 0.254: M1.4 62.6,104.58 M2.4 M3.4 62.52,96.02 62,95.5 46,95.5 43.75,97.75 35.52,97.75 35.27,97.5 3.3V/5V.2

### Text on the board
tPlace: GND | +12v | OUT | GND | +12v | OUT | GND | +12v | P1KY001 distance sensors | OUT
tNames: +3.3V | - | BAT | + | driver M1 - OUT | driver M2 - OUT | driver M3 - OUT | GND | OUT1 | OUT2 | GND | VCC | ENC1 | ENC2 | +5V | M1 | switch | +5V | GND | SCL | SDA | A0 | A1 | A2 | A3 | M2 | SCL | OUT | SDA | +3.3V | M3 | I2C | 5VREG | GND | Sharp sensors | - | Arduino UNO GPIO | A5 | A4 | A3 | A2 | A1 | A0 | Gyroscope | +3.3V | GND | SCL | SDA | + | - | driver 1 power | Raspberry power | + | World Robot Summit 2020/Japan | 2 x FUSE 20A | D0 | D1 | D2 | D3 | D4 | D5 | D6 | D7 | D8 | D9 | D10 | D11 | D12 | D13 | SDA | SCL | driver 2 - control | driver 1 - control | Arduino UNO GPIO | GND | +5V | PWM | Raspberry Pi GPIO | GND | servo 1 | servo 2 | servo 3 | servo 4 | servo 5 | servo 6 | servo 7 | servo 8
bNames: GND | +5V | Fan